# Altium schematic sheet Microcontroller.SchDoc
size 297 x 209 mm
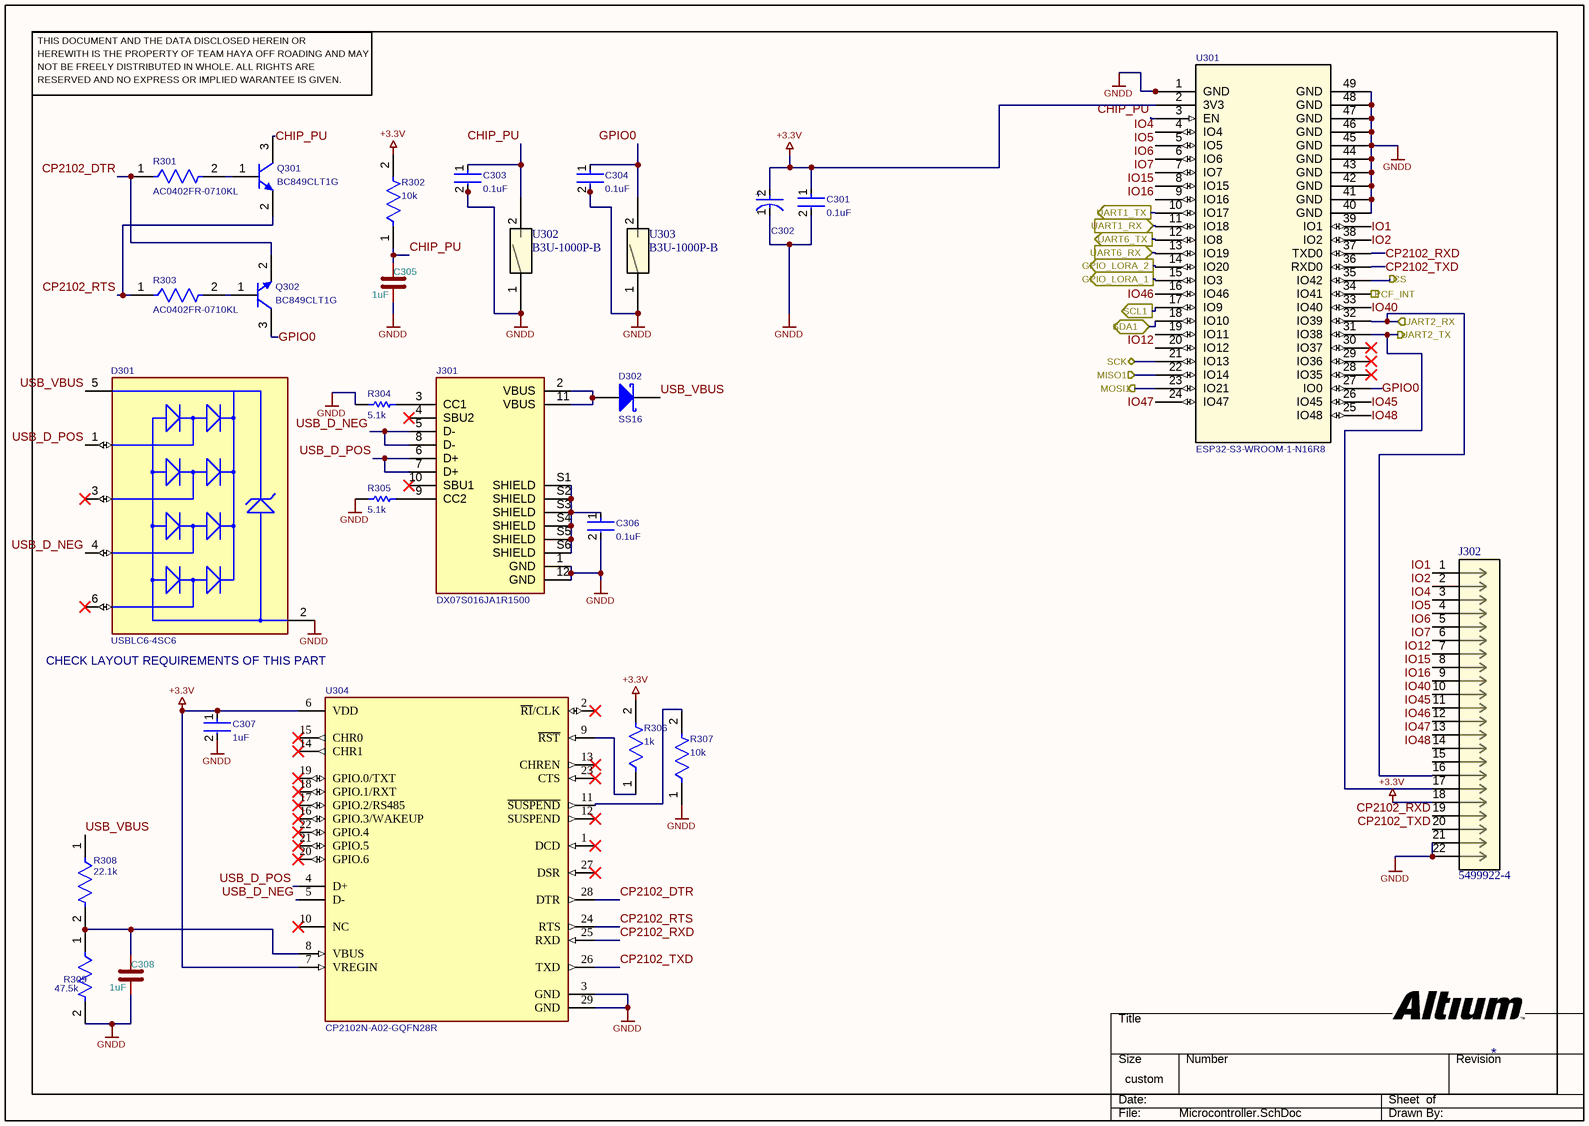
[diagram p0: Microcontroller.SchDoc]

## Parts
C301  0.1uF  [FP-CC0402-MFG]
C302  EEEFK1V100R  [FP-FKC-MFG]  (value not drawn)
C303  0.1uF  [FP-CC0402-MFG]
C304  0.1uF  [FP-CC0402-MFG]
C305  1uF  [C_0603_1608Metric_Pad1.08x0.95mm_HandSolder]
C306  0.1uF  [FP-CC0402-MFG]
C307  1uF  [FP-CC0603-DA-MFG]
C308  1uF  [C_0603_1608Metric_Pad1.08x0.95mm_HandSolder]
D301  USBLC6-4SC6  [FP-SOT23-6L-MFG]
D302  SS16  [FAIR-SMA-2_B_V]
J301  DX07S016JA1R1500  [JAE_DX07S016JA1R1500]
J302  5499922-4  [CON20_2X10_SHM_TEC]
Q301  BC849CLT1G  [ONSC-SOT-23-3-318-08_V]
Q302  BC849CLT1G  [ONSC-SOT-23-3-318-08_V]
R301  AC0402FR-0710KL  [FP-AC0402-MFG]
R302  10k  [FP-RC0603-0_55-IPC_C]
R303  AC0402FR-0710KL  [FP-AC0402-MFG]
R304  5.1k  [RESC1005X40X25NL05T10]
R305  5.1k  [RESC1005X40X25NL05T10]
R306  1k  [FP-RC0402-0_4-IPC_A]
R307  10k  [FP-RC0603-0_55-IPC_C]
R308  22.1k  [FP-RMCF0603-IPC_C]
R309  47.5k  [FP-AC0603-MFG]
U301  ESP32-S3-WROOM-1-N16R8  [ESP32-S3-WROOM-1_EXP]
U302  B3U-1000P-B  [B3U-1000P-B]
U303  B3U-1000P-B  [B3U-1000P-B]
U304  CP2102N-A02-GQFN28R  [FP-CP2102N-A02-GQFN28R-MFG]

## Ports
CS (out), GPIO_LORA_1 (out), GPIO_LORA_2 (out), MISO1 (in), MOSI1 (out), PCF_INT (out), SCK (bidir), SCL1 (out), SDA1 (bidir), UART1_RX (in), UART1_TX (out), UART2_RX (in), UART2_TX (out), UART6_RX (in), UART6_TX (out)

## Nets
+3.3V: C301.1 C302.2(A) C307.1 J302.18 R302.2 R306.2 U301.2(3V3) U304.6(VDD) U304.7(VREGIN)
GNDD: C301.2 C302.1(C) C303.2 C304.2 C305.2 C306.2 C307.2 C308.2 D301.2(GND) J301.1(GND) J301.12(GND) J302.21 J302.22 R304.1 R305.1 R307.1 R309.2 U301.1(GND) U301.40(GND) U301.41(GND) U301.42(GND) U301.43(GND) U301.44(GND) U301.45(GND) U301.46(GND) U301.47(GND) U301.48(GND) U301.49(GND) U302.1 U303.1 U304.3(GND) U304.29(GND)
CHIP_PU: C303.1 C305.1 Q301.3(C) R302.1 U301.3(EN) U302.2
CP2102_DTR: Q302.2(E) R301.1 U304.28(DTR)
CP2102_RTS: Q301.2(E) R303.1 U304.24(RTS)
CP2102_RXD: J302.19 U301.37(TXD0) U304.25(RXD)
CP2102_TXD: J302.20 U301.36(RXD0) U304.26(TXD)
CS: U301.35(IO42) ; port CS
GPIO0: C304.1 Q302.3(C) U301.27(IO0) U303.2
GPIO_LORA_1: U301.15(IO3) ; port GPIO_LORA_1
GPIO_LORA_2: U301.14(IO20) ; port GPIO_LORA_2
IO1: J302.1 U301.39(IO1)
IO2: J302.2 U301.38(IO2)
IO4: J302.3 U301.4(IO4)
IO5: J302.4 U301.5(IO5)
IO6: J302.5 U301.6(IO6)
IO7: J302.6 U301.7(IO7)
IO12: J302.7 U301.20(IO12)
IO15: J302.8 U301.8(IO15)
IO16: J302.9 U301.9(IO16)
IO40: J302.10 U301.33(IO40)
IO45: J302.11 U301.26(IO45)
IO46: J302.12 U301.16(IO46)
IO47: J302.13 U301.24(IO47)
IO48: J302.14 U301.25(IO48)
MISO1: U301.22(IO14) ; port MISO1
MOSI1: U301.23(IO21) ; port MOSI1
PCF_INT: U301.34(IO41) ; port PCF_INT
SCK: U301.21(IO13) ; port SCK
SCL1: U301.17(IO9) ; port SCL1
SDA1: U301.18(IO10) ; port SDA1
UART1_RX: U301.11(IO18) ; port UART1_RX
UART1_TX: U301.10(IO17) ; port UART1_TX
UART2_RX: J302.16 U301.32(IO39) ; port UART2_RX
UART2_TX: J302.17 U301.31(IO38) ; port UART2_TX
UART6_RX: U301.13(IO19) ; port UART6_RX
UART6_TX: U301.12(IO8) ; port UART6_TX
USB_D_NEG: D301.4(I/O3) J301.5(D-) J301.8(D-) U304.5(D-)
USB_D_POS: D301.1(I/O1) J301.6(D+) J301.7(D+) U304.4(D+)
USB_VBUS: D301.5(VBUS) D302.2(K) R308.1
NetC306_1: C306.1 J301.S1(SHIELD) J301.S2(SHIELD) J301.S3(SHIELD) J301.S4(SHIELD) J301.S5(SHIELD) J301.S6(SHIELD)
NetC308_1: C308.1 R308.2 R309.1 U304.8(VBUS)
NetD302_1: D302.1(A) J301.2(VBUS) J301.11(VBUS)
NetJ301_3: J301.3(CC1) R304.2
NetJ301_9: J301.9(CC2) R305.2
NetQ301_1: Q301.1(B) R301.2
NetQ302_1: Q302.1(B) R303.2
NetR306_1: R306.1 U304.9(~{RST})
NetR307_2: R307.2 U304.11(~{SUSPEND})

Not connected (* = marked no-connect by the designer): D301 3(I/O2)* 6(I/O4)*; J301 4(SBU2)* 10(SBU1)*; J302 15; U301 19(IO11) 28(IO35)* 29(IO36)* 30(IO37)*; U304 1(DCD)* 2(~{RI}/CLK)* 10(NC)* 12(SUSPEND)* 13(CHREN)* 14(CHR1)* 15(CHR0)* 16(GPIO.3/WAKEUP)* 17(GPIO.2/RS485)* 18(GPIO.1/RXT)* 19(GPIO.0/TXT)* 20(GPIO.6)* 21(GPIO.5)* 22(GPIO.4)* 23(CTS)* 27(DSR)*

## Notes on the sheet
- CHECK LAYOUT REQUIREMENTS OF THIS PART
- THIS DOCUMENT AND THE DATA DISCLOSED HEREIN OR
- HEREWITH IS THE PROPERTY OF TEAM HAYA OFF ROADING AND MAY
- NOT BE FREELY DISTRIBUTED IN WHOLE. ALL RIGHTS ARE
- RESERVED AND NO EXPRESS OR IMPLIED WARANTEE IS GIVEN.
- (in symbol CMP-05427-000097-1) +

## Library data of the parts
C301 C303 C304 C306 = CMP-03422-001010-1: CAP CER 0.1UF 50V X7R 0402 / CC0402KRX7R9BB104; Manufacturer: YAGEO; Capacitance: 100 nF; Temperature Coefficient: 30ppm/°C; Material: Ceramic; Value: 100 nF; Automotive Grade: NA; Tolerance: 0.1; Footprint Url: http://www.yageo.com/exep/pages/download/literatures/UPY-C_GEN_24.pdf; Category: Cap; Package: CC0402; Voltage Rating: 50 V; ComponentLink2Description: Datasheet; Temperature Characteristic: X7R; Device Class L1: Passive Components; Device Class L2: Capacitors; Digikey Description: CAP CER 0.1UF 50V X7R 0402; Octopart: https://octopart.com/cc0402krx7r9bb104-yageo-56536067; Device Class L3: Ceramic Capacitors; Height: 0.55mm; Temperature: -55°C to +125°C; Temperature Range High: +125°C; ComponentLink2URL: http://www.yageo.com/documents/recent/UPY-GP_NP0_16V-to-50V_16.pdf; Temperature Range Low: -55°C; RoHS: TRUE; Ipc Land Pattern Name: CAPC10050X50; Lead Free: Yes; Automotive: No; Manufacturer Part Number: CC0402KRX7R9BB104
C302 = CMP-05427-000097-1: CAP ALUM 10UF 20% 35V SMD; Leakage Current: 3uA; Ripple Current: 160mA; Material: Aluminium; Impedance: 700mR; Life (Hours): 2000Hour; Radiation Hardening: No; Packaging: Tape and Reel; Construction: Cylindrical; Max Operating Temperature: 105°C; Contact Plating: Tin; Voltage Rating (DC): 35V; Series: FK; Tolerance: 20%; Voltage: 35V; RoHS Compliant: Yes; Capacitance: 10uF; Package Quantity: 1; Voltage Rating: 35V; Width: 6.5mm; ESR (Equivalent Series Resistance): 700mR; Lead Free: Lead Free; Number of Pins: 2; Height - Seated (Max): 0.228inch; Diameter: 5mm; Termination: SMD/SMT; Min Operating Temperature: -55°C; Ripple Current (AC): 160mA; Height: 5.8mm; Case/Package: Radial; Length: 5.8mm; Mount: Surface Mount
C305 C308 = C: CC0603KRX7R0BB105; Value: 1uF; Footprint: Capacitor_SMD:C_0603_1608Metric_Pad1.08x0.95mm_HandSolder
C307 = CMP-03422-000924-1: CAP CER 1UF 16V X7R 0603; Manufacturer: YAGEO; Manufacturer Part Number: CC0603KRX7R7BB105; Tolerance: 0.1; Temperature Coefficient: 15%; Material: Ceramic; Package: CC0603-DA; RoHS: TRUE; Device Class L2: Capacitors; Temperature Characteristic: X7R; Temperature: -55°C to +125°C; Temperature Range Low: -55°C; Automotive: No; ComponentLink2Description: Datasheet; Value: 1 uF; Lead Free: Yes; Capacitance: 1 uF; ComponentLink2URL: http://www.yageo.com/documents/recent/UPY-GPHC_X7R_6.3V-to-50V_18.pdf; Device Class L1: Passive Components; Voltage: 16 V; Octopart: https://octopart.com/cc0603krx7r7bb105-yageo-42271928; Category: Cap; Digikey Description: CAP CER 1UF 16V X7R 0603; Footprint Url: http://www.yageo.com/exep/pages/download/literatures/UPY-C_GEN_24.pdf; Height: 0.9mm; Voltage Rating: 16 V; Temperature Range High: +125°C; Mouser Description: Multilayer Ceramic Capacitor, CC Series, 1 - F, - 10%, X7R, 16 V, 0603 [1608 Metric]; Device Class L3: Ceramic Capacitors
D301 = CMP-2000-07370-2: TVS DIODE 5.25V 17V SOT23-6; Manufacturer: STMicroelectronics; Peak Pulse Power: 130W; Breakdown Voltage: 6V; Value: 3pF; Direction: Unidirectional; Interface: USB,Ethernet,Other; Number Of Channels: 4; Standoff Height: 0mm; Max Junction Temp: +125°C; Digikey Description: TVS DIODE 5.25V 17V SOT23-6; Automotive: No; Package: SOT23-6L; Mouser Description: USBLC6 Series 4 Line 6 V Uni / Bi-Directional ESD Protection - SOT-23-6; Octopart: https://octopart.com/usblc6-4sc6-stmicroelectronics-347147; RoHS: TRUE; ComponentLink2URL: https://upverter.com/datasheet/23dc4ffb028d868909e80577610284b194f13213.pdf; ComponentLink2Description: Datasheet; Device Class L1: Circuit Protection; Lead Free: Yes; Temperature Range High: +125°C; Device Class L2: ESD and Circuit Protection ICs; Device Class L3: unset; Capacitance: 3pF; Height: 1.45mm; Temperature Range Low: -40°C; Manufacturer Part Number: USBLC6-4SC6; Temperature: -40°C to +125°C; Category: Diode; Clamping Voltage: 17V
D302 = CMP-2000-07149-1: Schottky Rectifier, 700 mV, -65 to 125 degC, 2-Pin SMA, RoHS, Tape and Reel; Manufacturer: FairchildSemiconductor; Type: SchottkyDiode; Peak Average Forward Current: 1@Ta=75CA; Peak Reverse Current: 200uA; Peak Non-Repetitive Surge Current: 40A; Configuration: Single; Peak Forward Voltage: 0.7V; Peak Reverse Repetitive Voltage: 60V; Package: 2DO-214AC; Datasheet URL: http://www.mouser.com/ds/2/149/SS16-196707.pdf; Package Description: 2-Pin Surface Mount Device, Body 4.375 x 2.725 mm; Packaging: Tape&Reel; Package Reference: SMA-2; Mounting: SurfaceMount; Operating Temperature: -65to125°C; Datasheet Version: Rev. 1.9, 01/2015; Mounting Technology: SurfaceMount; Category: Rectifier; Manufacturer URL: https://www.fairchildsemi.com/
J301 = DX07S016JA1R1500: USB-C (USB TYPE-C) USB 2.0 Receptacle Connector 24 (16+8 Dummy) Position Surface Mount, Right Angle; Through Hole; Package: None; Value: *; Price: None; MP: DX07S016JA1R1500; Availability: Unavailable
J302 = 5499922-4: No Description Available; Mfr_Name: TE Connectivity; RefDes: RefDes; Type: Type
Q301 Q302 = CMP-1048-00726-1: General Purpose Transistor, NPN Silicon, 3-Pin SOT-23, Pb-Free, Tape and Reel; Manufacturer: On Semiconductor; fT Min (MHz): 100; IC Continuous (A): 0.1; ComponentLink3Description: Package Specification; Mounting Technology: Surface Mount; ComponentLink3URL: http://www.onsemi.cn/pub_link/Collateral/318-08.PDF; PartNumber: BC849CLT1G; Polarity: NPN; ComponentLink2URL: http://www.onsemi.cn/pub_link/Collateral/BC846ALT1-D.PDF; PackageDescription: 3-Pin Small Outline Transistor, Body 2.92 x 1.3 mm, Pitch 0.95 mm; PackageReference: SOT-23-3-318-08; DatasheetVersion: Rev. 11; RoHS: TRUE; Packing: Tape and Reel; ComponentLink1Description: Manufacturer URL; ComponentLink2Description: Datasheet; ComponentLink1URL: http://www.onsemi.com/; PackageVersion: Rev. AP, 11/2009
R301 R303 = CMP-2002-01790-3: RES 10kΩ ±1% 0.063W 0402; Power Rating: 62.5mW; Voltage Rating: 50V; Temperature Coefficient: 100ppm/°C; Resistance: 10kR; Max Power Dissipation: 63mW; Tolerance: 1%; Military Standard: Not; Construction: Rectangular; Termination: SMD/SMT; Max Operating Temperature: 155°C; Min Operating Temperature: -55°C; Height: 0.015inch; Lead Free: Lead Free; Width: 0.02inch; Case/Package: 0402; Resistor Type: Thick Film; Series: AC; Features: Moisture Resistant; RoHS Compliant: Yes; Number of Terminations: 2; Case Code (Metric): 1005; Length: 0.039inch; Depth: 0.5mm; Size Code: 0402; Packaging: Tape and Reel; Case Code (Imperial): 0402
R302 R307 = CMP-2100-03664-2: RES 10K OHM 1% 1/10W 0603 / RC0603FR-0710KL; Voltage Rating: 75V; Voltage Rating (DC): 50V; Resistance: 10kR; Power Rating: 100mW; Temperature Coefficient: 100ppm/°C; Depth: 0.8mm; Termination: SMD/SMT; Resistor Type: Thick Film; Series: RC; Construction: Rectangular; Features: Moisture Resistant; Packaging: Tape and Reel; Min Operating Temperature: -55°C; Number of Terminations: 2; Lead Pitch: 0.3mm; RoHS Compliant: Yes; Case/Package: 0603; Resistance Tolerance: 1%; Military Standard: Not; Weight: 7.1E-05oz; Number of Pins: 2; Tolerance: 1%; Length: 1.6mm; Case Code (Imperial): 0603; Lead Free: Lead Free; Width: 0.8mm; Max Power Dissipation: 100mW; Height: 0.45mm; Max Operating Temperature: 155°C; Case Code (Metric): 1608; Size Code: 0603
R304 R305 = CMP-2002-07753-1: RC0402FR-075K1L; Manufacturer: Yageo / Phycomp; Part Number: RC0402FR-075K1L
R306 = CMP-2002-07472-3: RES 1K OHM 1% 1/16W 0402 / RC0402FR-071KL; Max Power Dissipation: 63mW; Resistance: 1kR; Voltage Rating (DC): 50V; Temperature Coefficient: 100ppm/°C; Power Rating: 62.5mW; Technology: THICK FILM; Size Code: 0402; Series: RC; Length: 1mm; Case/Package: 0402; Features: Moisture Resistant; Termination: SMD/SMT; Case Code (Metric): 1005; Reach SVHC Compliant: Yes; Number of Terminations: 2; Tolerance: 1%; Lead Free: Lead Free; Military Standard: Not; Resistor Type: Thick Film; Max Operating Temperature: 155°C; RoHS Compliant: Yes; Construction: Rectangular; Voltage Rating: 50V; Packaging: Tape and Reel; Height: 0.32mm; Number of Pins: 2; Resistance Tolerance: 1%; Case Code (Imperial): 0402; Depth: 0.5mm; Min Operating Temperature: -55°C; Width: 0.5mm
R308 = CMP-26527-005902-1: 22.1kΩ ±1% 0.1W 0603 Thick Film Chip Resistor AEC-Q200 compliant / RMCF0603FT22K1; Resistance: 22.1kR; Max Power Dissipation: 100mW; Temperature Coefficient: 100ppm/°C; Contact Plating: Tin; Size Code: 0603; Number of Terminations: 2; Series: RMCF; Mount: Surface Mount; Lead Free: Lead Free; Min Operating Temperature: -55°C; Height: 0.022inch; Resistor Type: Thick Film; Case Code (Metric): 1608; Case/Package: 0603; Packaging: Tape and Reel; Features: Automotive AEC-Q200; Power Rating: 100mW; Length: 0.061inch; Construction: Rectangular; Width: 0.031inch; Package Quantity: 1; Radiation Hardening: No; Military Standard: Not; Case Code (Imperial): 0603; RoHS Compliant: Yes; Tolerance: 1%; Depth: 0.8mm; Max Operating Temperature: 155°C
R309 = CMP-03412-027829-2: RES 47.5KΩ 1.00% 0.1W 0603 / AC0603FR-0747K5L; Tolerance: 1%; Temperature Coefficient: 100ppm/°C; Resistance: 47.5kR; Voltage Rating: 50V; Power Rating: 100mW; RoHS Compliant: Yes; Case Code (Metric): 1608; Series: AC; Features: Moisture Resistant; Width: 0.8mm; Case Code (Imperial): 0603; Packaging: Tape and Reel; Termination: SMD/SMT; Number of Terminations: 2; Max Operating Temperature: 155°C; Case/Package: 0603; Resistor Type: Thick Film; Min Operating Temperature: -55°C; Height: 0.022inch; Ratings: AEC-Q200; Length: 0.063inch; Max Power Dissipation: 100mW
U301 = ESP32-S3-WROOM-1-N16R8: No Description Available; Mfr_Name: Espressif Systems; RefDes: RefDes; Type: Type
U302 U303 = B3U-1000P-B: No Description Available; Mfr_Name: Omron; RefDes: RefDes; Type: Type
U304 = CMP-08093-000007-1: IC USB TO UART BRIDGE QFN28